# Altium schematic sheet CONNECTIONS.SchDoc: CONNECTIONS
size A4; DocumentNumber: 7; Revision: 2.0; SheetNumber: 7; SheetTotal: 18
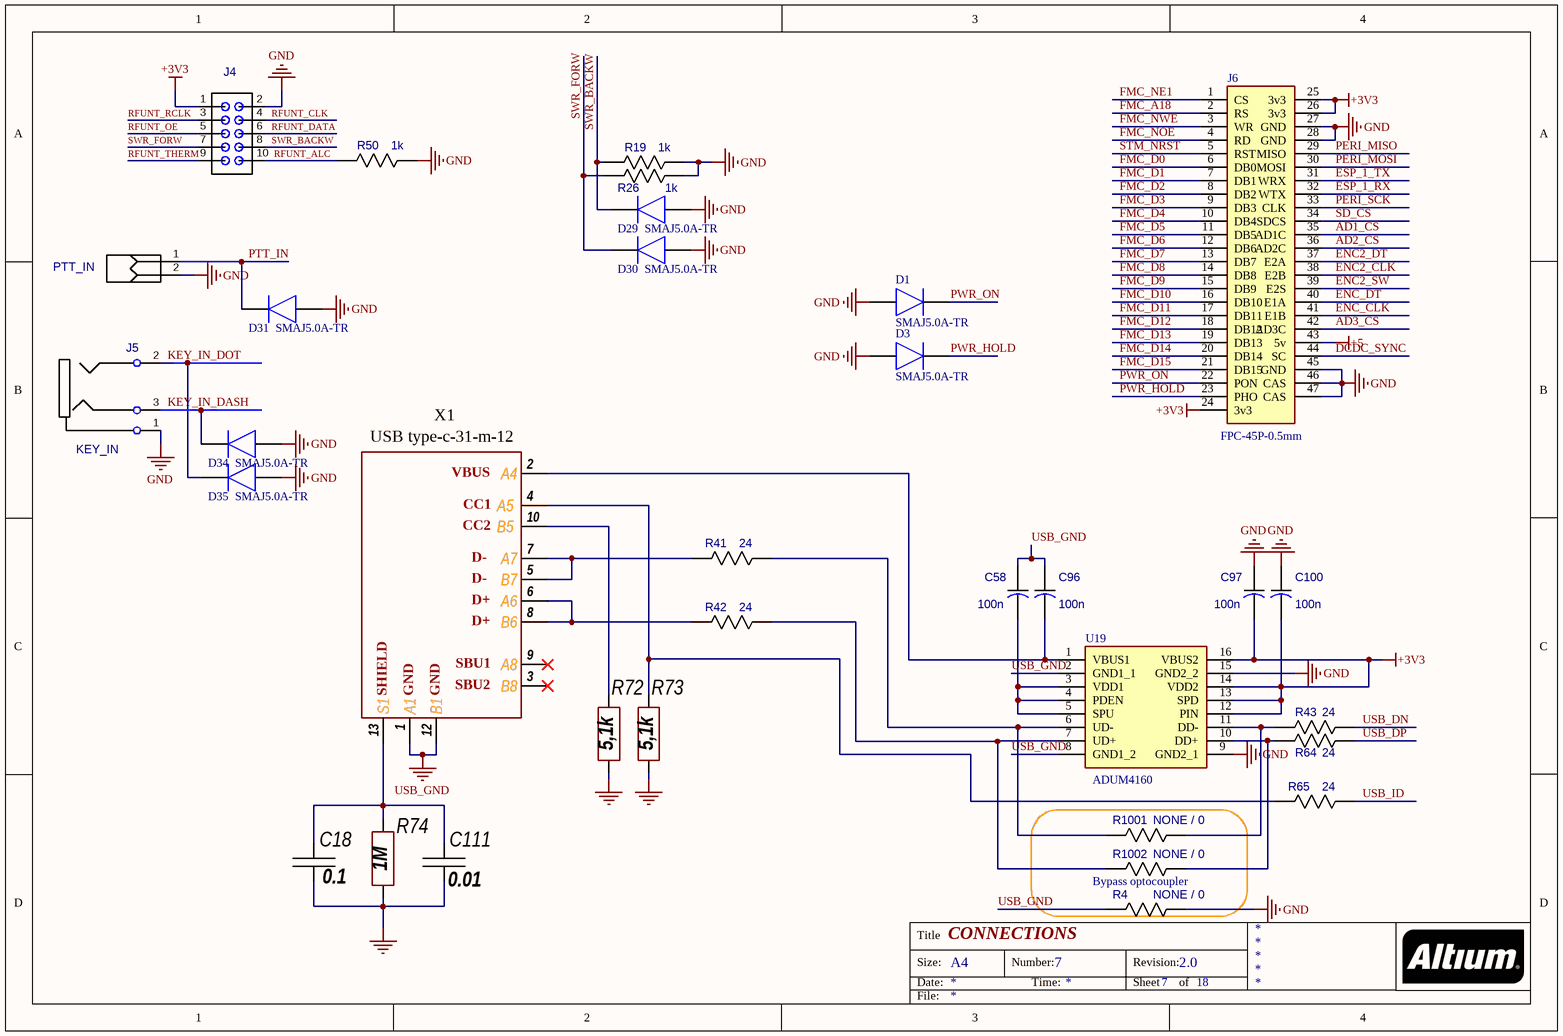
[diagram p0: CONNECTIONS.SchDoc]

## Parts
C18  0.1  [CH0805C]
C58  100n  [CAP_0805]
C96  100n  [CAP_0805]
C97  100n  [CAP_0805]
C100  100n  [CAP_0805]
C111  0.01  [CH0805C]
D1  SMAJ5.0A-TR  [SMBJ36CATR]
D3  SMAJ5.0A-TR  [SMBJ36CATR]
D29  SMAJ5.0A-TR  [SMBJ36CATR]
D30  SMAJ5.0A-TR  [SMBJ36CATR]
D31  SMAJ5.0A-TR  [SMBJ36CATR]
D34  SMAJ5.0A-TR  [SMBJ36CATR]
D35  SMAJ5.0A-TR  [SMBJ36CATR]
J4  (no value)  [IDC10]
J5  value KEY_IN  [SJ1-3525NG]  (hidden comment: SJ1-3525NG)
J6  FPC-45P-0.5mm  [FH12S45S05SH60]
PTT_IN  PTT_IN  [51022-0200]  (value not drawn)
R4  NONE / 0  [RES_0805]
R19  1k  [RES_0805]
R26  1k  [RES_0805]
R41  24  [RES_0805]
R42  24  [RES_0805]
R43  24  [RES_0805]
R50  1k  [RES_0805]
R64  24  [RES_0805]
R65  24  [RES_0805]
R72  5,1k  [CH0805R]
R73  5,1k  [CH0805R]
R74  1M  [CH0805R]
R1001  NONE / 0  [RES_0805]
R1002  NONE / 0  [RES_0805]
U19  ADUM4160  [SOIC127P1032X265-16N]
X1  USB type-c-31-m-12  [TYPE-C-31-M-12_V1]

## Blocks framed on the sheet
Bypass optocoupler: R4 R1001 R1002

## Nets
+3V3: C97.2 C100.2 J4.1 J6.24(3v3) J6.25(3v3) J6.26(3v3) U19.12(PIN) U19.13(SPD) U19.14(VDD2) U19.16(VBUS2)
+5: J6.43(5v)
GND: C18.1 C97.1 C100.1 C111.1 D1.2(A) D3.2(A) D29.2(A) D30.2(A) D31.2(A) D34.2(A) D35.2(A) J4.2 J5.1(sleeve) J6.27(GND) J6.28(GND) J6.45(GND) J6.46(CAS) J6.47(CAS) PTT_IN.2 R4.2 R19.2 R26.2 R50.2 R72.1 R73.1 R74.1 U19.9(GND2_1) U19.15(GND2_2)
USB_GND: C58.1 C96.1 R4.1 U19.2(GND1_1) U19.8(GND1_2) X1.1(A1) X1.12(B1)
AD1_CS: J6.35(AD1C)
AD2_CS: J6.36(AD2C)
AD3_CS: J6.42(AD3C)
DCDC_SYNC: J6.44(SC)
ENC2_CLK: J6.38(E2B)
ENC2_DT: J6.37(E2A)
ENC2_SW: J6.39(E2S)
ENC_CLK: J6.41(E1B)
ENC_DT: J6.40(E1A)
ESP_1_RX: J6.32(WTX)
ESP_1_TX: J6.31(WRX)
FMC_A18: J6.2(RS)
FMC_D0: J6.6(DB0)
FMC_D1: J6.7(DB1)
FMC_D2: J6.8(DB2)
FMC_D3: J6.9(DB3)
FMC_D4: J6.10(DB4)
FMC_D5: J6.11(DB5)
FMC_D6: J6.12(DB6)
FMC_D7: J6.13(DB7)
FMC_D8: J6.14(DB8)
FMC_D9: J6.15(DB9)
FMC_D10: J6.16(DB10)
FMC_D11: J6.17(DB11)
FMC_D12: J6.18(DB12)
FMC_D13: J6.19(DB13)
FMC_D14: J6.20(DB14)
FMC_D15: J6.21(DB15)
FMC_NE1: J6.1(CS)
FMC_NOE: J6.4(RD)
FMC_NWE: J6.3(WR)
KEY_IN_DASH: D34.1(K) J5.3(ring)
KEY_IN_DOT: D35.1(K) J5.2(tip)
PERI_MISO: J6.29(MISO)
PERI_MOSI: J6.30(MOSI)
PERI_SCK: J6.33(CLK)
PTT_IN: D31.1(K) PTT_IN.1
PWR_HOLD: D3.1(K) J6.23(PHO)
PWR_ON: D1.1(K) J6.22(PON)
RFUNT_ALC: J4.10 R50.1
RFUNT_CLK: J4.4
RFUNT_DATA: J4.6
RFUNT_OE: J4.5
RFUNT_RCLK: J4.3
RFUNT_THERM: J4.9
SD_CS: J6.34(SDCS)
STM_NRST: J6.5(RST)
SWR_BACKW: D29.1(K) J4.8 R19.1
SWR_FORW: D30.1(K) J4.7 R26.1
USB_DN: R43.2
USB_DP: R64.2
USB_ID: R65.2
NetC18_2: C18.2 C111.2 R74.2 X1.13(S1)
NetC58_2: C58.2 U19.3(VDD1) U19.4(PDEN) U19.5(SPU)
NetC96_2: C96.2 U19.1(VBUS1) X1.2(A4)
NetR41_1: R41.1 X1.5(B7) X1.7(A7)
NetR41_2: R41.2 R1001.1 U19.6(UD-)
NetR42_1: R42.1 X1.6(A6) X1.8(B6)
NetR42_2: R42.2 R1002.1 U19.7(UD+)
NetR43_1: R43.1 R1001.2 U19.11(DD-)
NetR64_1: R64.1 R1002.2 U19.10(DD+)
NetR65_1: R65.1 R73.2 X1.4(A5)
NetR72_2: R72.2 X1.10(B5)

Not connected (* = marked no-connect by the designer): X1 3(B8)* 9(A8)*

## Notes on the sheet
- Title
- Size:
- Date:
- A4
- Number:
- Time:
- Revision:
- Sheet
- of
- File:
- (in symbol USB-C_2.0) VBUS; CC1; CC2; D-; D+; SBU1; SHIELD; GND; SBU2

## Library data of the parts
C18 C111 = Capacitor: Manufacturer: *; Model: *; HelpURL: *; ComponentKind: *; Value: *
C58 C96 C97 C100 = CAP_0805: Value: 100n
D1 D3 D29-D31 D34 D35 = SMLVT3V3: Diode; Manufacturer_Name: STMicroelectronics; Allied_Number: 70013736; Datasheet Link: http://www.st.com/web/en/resource/technical/document/datasheet/CD00000923.pdf; Height: 2.65mm; Manufacturer_Part_Number: SMLVT3V3; Mouser Part Number: 511-SMLVT3V3; Mouser Price/Stock: https://www.mouser.com/Search/Refine.aspx?Keyword=511-SMLVT3V3; RS Part Number: 5444821P; RS Price/Stock: http://uk.rs-online.com/web/p/products/5444821P; Allied Price/Stock: http://www.alliedelec.com/stmicroelectronics-smlvt3v3/70013736/
  D31: LCSC Part #: test
J4 = IDC10: 2*5 Pin
J5 = SJ1-3523N
J6 = FH12S-45S-0.5SH_55_: Connector; Manufacturer_Name: Hirose; Manufacturer_Part_Number: FH12S-45S-0.5SH(55); Datasheet Link: https://www.hirose.com/product/en/download_file/key_name/FH12S-45S-0.5SH%2855%29/category/Drawing%20(2D)/doc_file_id/43881/?file_category_id=6&item_id=05860665055&is_series=; Height: 2mm; Mouser Part Number: 798-FH12S-45S-05SH55; Mouser Price/Stock: https://www.mouser.co.uk/ProductDetail/Hirose-Connector/FH12S-45S-05SH55?qs=0N%252BVULUZFj%252BE0LA99Ny0NA%3D%3D; RS Part Number: 1620942; RS Price/Stock: http://uk.rs-online.com/web/p/products/1620942
PTT_IN = 51022-0200
R4 R19 R26 R41-R43 R50 R64 R65 R1001 R1002 = RES_0805
  R19 R26 R50: Value: 1k
R72-R74 = Resistor: Manufacturer: *; Model: *; HelpURL: *; ComponentKind: *; Value: *
U19 = ADUM4160BRWZ: Integrated Circuit; Manufacturer_Name: Analog Devices; Datasheet Link: http://uk.rs-online.com/web/p/products/9129526; Height: 2.65mm; Manufacturer_Part_Number: ADUM4160BRWZ; Mouser Part Number: 584-ADUM4160BRWZ; Mouser Price/Stock: https://www.mouser.co.uk/ProductDetail/Analog-Devices/ADUM4160BRWZ/?qs=WIvQP4zGanj8VHq3sVqu9A%3D%3D; Arrow Part Number: ADUM4160BRWZ; Arrow Price/Stock: https://www.arrow.com/en/products/adum4160brwz/analog-devices
X1 = USB-C_2.0